# EAGLE schematic Baxandall ne5532 (EAGLE 9.6.2)
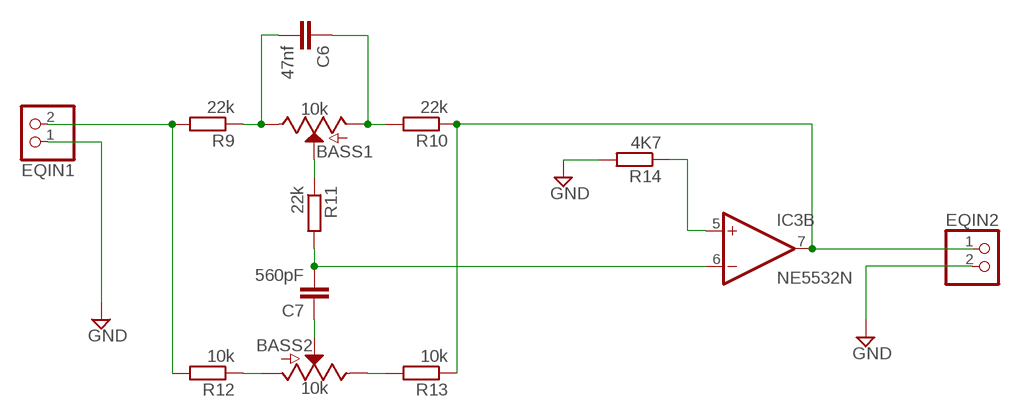
[diagram p0: schematic, sheet 1]

## Parts
BASS1  10k  POTENTIOMETER-PTH-9MM-1/20W-20%  [POT-PTH-ALPS]
BASS2  10k  POTENTIOMETER-PTH-9MM-1/20W-20%  [POT-PTH-ALPS]
C6  47nf  C2.5/2  [C2.5-2]
C7  560pF  C2.5/2  [C2.5-2]
EQIN1  PINHD-1X2  [1X02]
EQIN2  PINHD-1X2  [1X02]
IC3  NE5532N  [DIL08]
R9  22k  R-EU_0204/7  [0204/7]
R10  22k  R-EU_0204/7  [0204/7]
R11  22k  R-EU_0204/7  [0204/7]
R12  10k  R-EU_0204/7  [0204/7]
R13  10k  R-EU_0204/7  [0204/7]
R14  4K7  R-EU_0204/7  [0204/7]

## Nets
GND: EQIN1.1 EQIN2.2 R14.2
N$11: EQIN1.2 R9.2 R12.2
N$12: BASS1.P$1(E) C6.2 R9.1
N$13: BASS1.P$3(A) C6.1 R10.2
N$14: BASS1.P$2(S) R11.1
N$15: C7.2 IC3.6(B:-IN) R11.2
N$16: BASS2.P$2(S) C7.1
N$17: EQIN2.1 IC3.7(B:OUT) R10.1 R13.1
N$18: BASS2.P$1(E) R13.2
N$19: BASS2.P$3(A) R12.1
N$21: IC3.5(B:+IN) R14.1
Unconnected: IC3.1(A:OUT) IC3.2(A:-IN) IC3.3(A:+IN)

## Power pins joined to a net without a drawn wire
V+: IC3.8(P:V+)
V-: IC3.4(P:V-)

## Library data of the parts
BASS1 BASS2 = SparkFun-Resistors:POTENTIOMETER: Potentiometer (Pot) Three-terminal potentiometers, with an adjustable wiper and two adjustable resistors. A pot can be used to create a configurable voltage divider, or as a variable resistor. Variants ALPS_POT and ALPS_POT_KIT - PTH, breadboard compatible, 9mm square pots Rotary Potentiometer - Linear (10k ohm) <https://www.sparkfun.com/products/9288> (COM-09288) The KIT variant exposes copper on only one side of the PTH pad, so the part can only be assembled on one side of the PCB. Useful for beginner soldering kits.; PROD_ID: RES-09177; SF_SKU: COM-09288
C6 C7 = capacitor-wima:C: CAPACITOR naming: grid - package width
EQIN1 EQIN2 = pinhead:PINHD-1X2: PIN HEADER
IC3 = linear:NE5532: AUDIO AMPLIFIER
R9-R14 = rcl:R-EU_: RESISTOR, European symbol; SPICEPREFIX: R